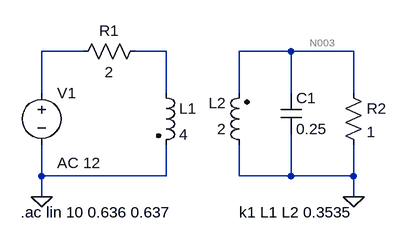
[diagram p0: schematic Task2.asc]
Task2.asc, the LTspice schematic file:
Version 4
SHEET 1 880 680
WIRE 160 48 96 48
WIRE 288 48 240 48
WIRE 480 48 400 48
WIRE 576 48 480 48
WIRE 96 112 96 48
WIRE 288 112 288 48
WIRE 400 112 400 48
WIRE 480 112 480 48
WIRE 576 112 576 48
WIRE 96 240 96 192
WIRE 288 240 288 192
WIRE 288 240 96 240
WIRE 400 240 400 192
WIRE 480 240 480 176
WIRE 480 240 400 240
WIRE 576 240 576 192
WIRE 576 240 480 240
WIRE 96 272 96 240
WIRE 576 272 576 240
FLAG 96 272 0
FLAG 576 272 0
SYMBOL voltage 96 96 R0
WINDOW 123 24 124 Left 2
WINDOW 39 0 0 Left 0
SYMATTR Value2 AC 12
SYMATTR InstName V1
SYMATTR Value ""
SYMBOL res 144 64 R270
WINDOW 0 32 56 VTop 2
WINDOW 3 0 56 VBottom 2
SYMATTR InstName R1
SYMATTR Value 2
SYMBOL ind2 272 96 R0
SYMATTR InstName L1
SYMATTR Value 4
SYMATTR Type ind
SYMBOL ind2 416 208 R180
WINDOW 0 36 80 Left 2
WINDOW 3 36 40 Left 2
SYMATTR InstName L2
SYMATTR Value 2
SYMATTR Type ind
SYMBOL cap 464 112 R0
SYMATTR InstName C1
SYMATTR Value 0.25
SYMBOL res 560 96 R0
SYMATTR InstName R2
SYMATTR Value 1
TEXT 400 296 Left 2 !k1 L1 L2 0.3535
TEXT 64 296 Left 2 !.ac lin 10 0.636 0.637

The netlist it stands for:
* Task2.asc
V1 N001 0 AC 12
R1 N001 N002 2
L1 N002 0 4
L2 0 N003 2
C1 N003 0 0.25
R2 N003 0 1
k1 L1 L2 0.3535
.ac lin 10 0.636 0.637
.backanno
.end

* Results of the author's LTspice run, read from the files saved beside the schematic
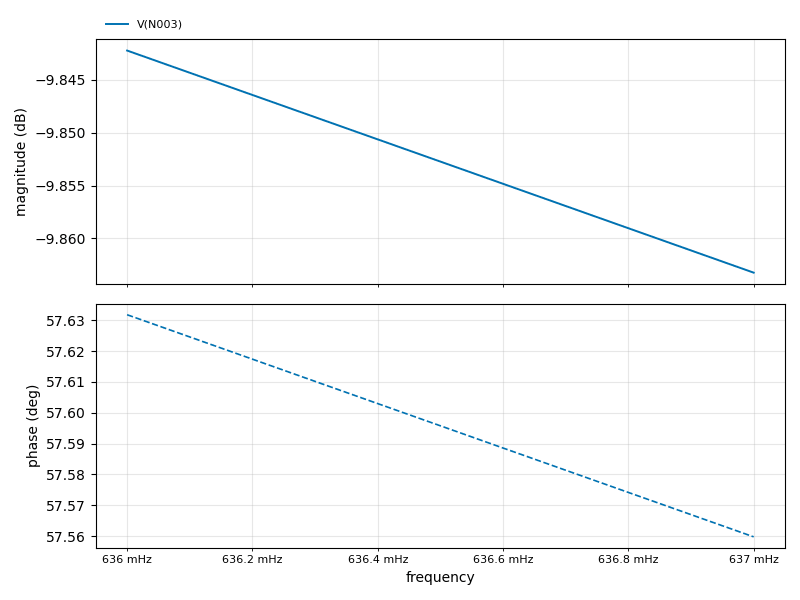
[diagram p1: AC Analysis of Task2.asc, plotted from the saved traces]
* AC Analysis, 1 run:
*   V(N003): -9.84 dB at 636 mHz, -9.86 dB at 637 mHz, peak -9.84 dB at 636 mHz